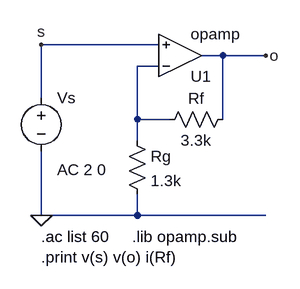
[diagram p0: schematic ECE2101L_Lab09_B1.asc]
ECE2101L_Lab09_B1.asc, the LTspice schematic file:
Version 4
SHEET 1 880 680
WIRE 144 96 -32 96
WIRE 240 112 208 112
WIRE 304 112 240 112
WIRE 144 128 112 128
WIRE -32 176 -32 96
WIRE 112 208 112 128
WIRE 160 208 112 208
WIRE 240 208 240 112
WIRE 112 240 112 208
WIRE -32 352 -32 256
WIRE 112 352 112 320
WIRE 112 352 -32 352
WIRE 304 352 112 352
FLAG 304 112 o
FLAG -32 352 0
FLAG -32 96 s
SYMBOL voltage -32 160 R0
WINDOW 123 24 124 Left 2
WINDOW 39 0 0 Left 0
SYMATTR InstName Vs
SYMATTR Value ""
SYMATTR Value2 AC 2 0
SYMBOL res 96 224 R0
SYMATTR InstName Rg
SYMATTR Value 1.3k
SYMBOL res 256 192 R90
WINDOW 0 0 56 VBottom 2
WINDOW 3 32 56 VTop 2
SYMATTR InstName Rf
SYMATTR Value 3.3k
SYMBOL Opamps\\opamp 176 176 M180
SYMATTR InstName U1
TEXT 104 384 Left 2 !.lib opamp.sub
TEXT -32 384 Left 2 !.ac list 60\n.print v(s) v(o) i(Rf)

The netlist it stands for:
* ECE2101L_Lab09_B1.asc
Vs s 0 AC 2 0
Rg N001 0 1.3k
Rf o N001 3.3k
XU1 N001 s o opamp Aol=100K GBW=10Meg  ; pins invin noninvin out
.lib opamp.sub
.ac list 60
.print v(s) v(o) i(Rf)
.backanno
.end